# EAGLE design Inverter (EAGLE 9.6.2)
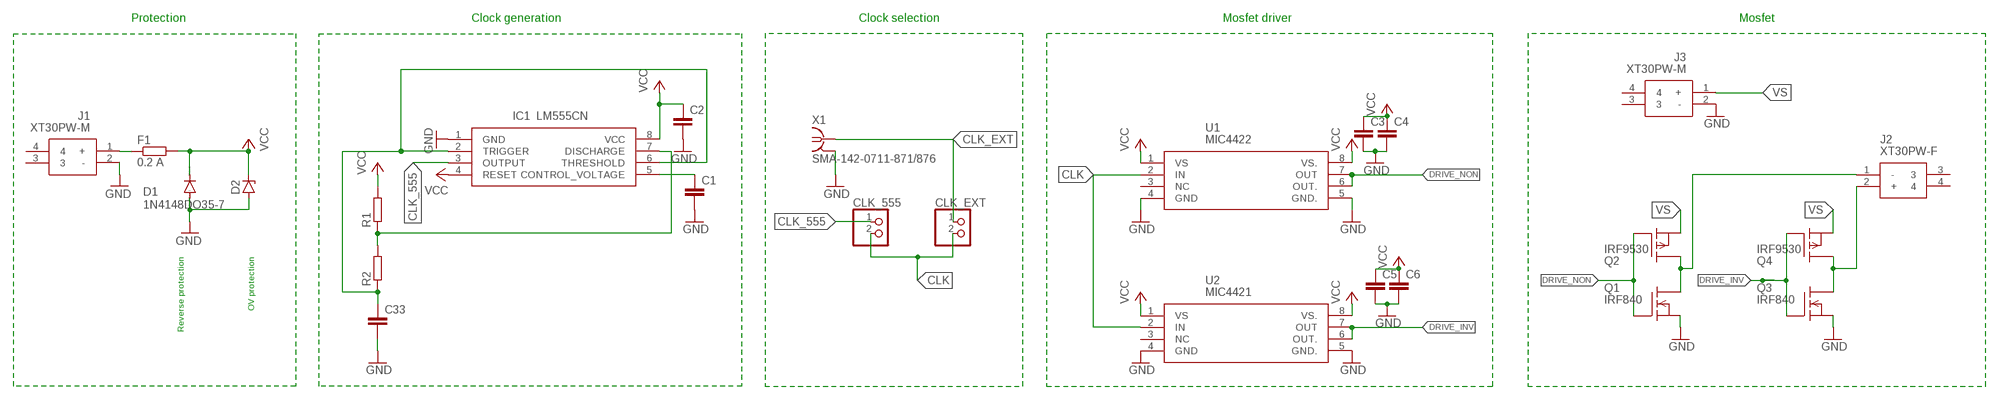
[diagram p0: schematic, sheet 1]

## Parts
C1  C-EU025-050X050  [C025-050X050]
C2  C-EUC0805  [C0805]
C3  C-EUC0805  [C0805]
C4  C-EUC0805  [C0805]
C5  C-EUC0805  [C0805]
C6  C-EUC0805  [C0805]
C33  C-EUC0805  [C0805]
CLK_555  PINHD-1X2  [1X02]
CLK_EXT  PINHD-1X2  [1X02]
D1  1N4148DO35-7  [DO35-7]
D2  ZENER-DIODEDO35Z10  [DO35Z10]
F1  0.2 A  R-EU_M1206  [M1206]
IC1  LM555CN  [DIP762W53P254L980H533Q8N]
J1  XT30PW-M  [XT30PWM]
J2  XT30PW-F  [XT30PWF]
J3  XT30PW-M  [XT30PWM]
Q1  IRF840  [TO220]
Q2  IRF9530  [TO220]
Q3  IRF840  [TO220]
Q4  IRF9530  [TO220]
R1  R-EU_M0805  [M0805]
R2  R-EU_M0805  [M0805]
U1  MIC4422  MIC4421!  [MIC4421]
U2  MIC4421  MIC4421!  [MIC4421]
X1  SMA-142-0711-871/876  [J502-ND-142-0711-871/876]

## Nets
CLK: CLK_555.2 CLK_EXT.2 U1.2(IN) U2.2(IN)
CLK_555: CLK_555.1 IC1.3(OUTPUT)
CLK_EXT: CLK_EXT.1 X1.1
DRIVE_INV: Q3.1(G) Q4.1(G) U2.6(OUT.) U2.7(OUT)
DRIVE_NON: Q1.1(G) Q2.1(G) U1.6(OUT.) U1.7(OUT)
GND: C1.2 C2.2 C3.2 C4.2 C5.2 C6.2 C33.2 D1.A D2.A IC1.1(GND) J1.2(-) J3.2(-) Q1.3(S) Q3.3(S) U1.4(GND) U1.5(GND.) U2.4(GND) U2.5(GND.) X1.G@1 X1.G@2 X1.G@3 X1.G@4
N$1: C33.1 IC1.2(TRIGGER) IC1.6(THRESHOLD) R2.1
N$2: IC1.7(DISCHARGE) R1.1 R2.2
N$3: C1.1 IC1.5(CONTROL_VOLTAGE)
N$4: J2.1(-) Q1.2(D) Q2.2(D)
N$5: J2.2(+) Q3.2(D) Q4.2(D)
N$11: F1.1 J1.1(+)
VCC: C2.1 C3.1 C4.1 C5.1 C6.1 D1.C D2.C F1.2 IC1.4(RESET) IC1.8(VCC) R1.2 U1.1(VS) U1.8(VS.) U2.1(VS) U2.8(VS.)
VS: J3.1(+) Q2.3(S) Q4.3(S)
Unconnected: J1.3 J1.4 J2.3 J2.4 J3.3 J3.4 U1.3(NC) U2.3(NC)

## Notes on the sheet
- Protection | Clock generation | Clock selection | Mosfet driver | Mosfet
- Reverse protection | OV protection

## Library data of the parts
C1-C6 C33 = rcl:C-EU: CAPACITOR, European symbol; SPICEPREFIX: C
CLK_555 CLK_EXT = pinhead:PINHD-1X2: PIN HEADER
D1 = diode:1N4148: DIODE high speed (Philips)
D2 = diode:ZENER-DIODE: Z-Diode
F1 R1 R2 = rcl:R-EU_: RESISTOR, European symbol; SPICEPREFIX: R
IC1 = LM555CN:LM555CN: ON Semiconductor LM555CN, Timer, 4.5 16 V, 8-Pin PDIP Source: Datasheet <http://www.onsemi.com/pub/Collateral/LM555-D.pdf>; ARROW_PART_NUMBER: LM555CN; ARROW_PRICE-STOCK: https://www.arrow.com/en/products/lm555cn/on-semiconductor; DESCRIPTION: ON Semiconductor LM555CN, Timer, 4.5 16 V, 8-Pin PDIP; HEIGHT: 5.33mm; MANUFACTURER_NAME: ON Semiconductor; MANUFACTURER_PART_NUMBER: LM555CN; MOUSER_PART_NUMBER: 512-LM555CN; MOUSER_PRICE-STOCK: https://www.mouser.co.uk/ProductDetail/ON-Semiconductor-Fairchild/LM555CN?qs=AFLC8Sm4xaX0SxPz974UPA%3D%3D
J1 J3 = XT30PW-M:XT30PW-M: 30A Low Temperature Rise Fire Retardant Plug Source: Datasheet <https://www.tme.eu/sl/Document/ce4077e36b79046da520ca73227e15de/XT30PW SPEC.pdf>; ARROW_PART_NUMBER: XT30PW-M; DESCRIPTION: 30A Low Temperature Rise Fire Retardant Plug; HEIGHT: 5mm; MANUFACTURER_NAME: Amass; MANUFACTURER_PART_NUMBER: XT30PW-M
J2 = XT30PW-F:XT30PW-F: Socket; DC supply; XT30; female; PIN:2; on PCBs; THT; Colour: yellow Source: Datasheet <https://www.tme.eu/Document/ce4077e36b79046da520ca73227e15de/XT30PW SPEC.pdf>; ARROW_PART_NUMBER: XT30PW-F; DESCRIPTION: Socket; DC supply; XT30; female; PIN:2; on PCBs; THT; Colour: yellow; HEIGHT: 5mm; MANUFACTURER_NAME: Amass; MANUFACTURER_PART_NUMBER: XT30PW-F
Q1 Q3 = transistor-fet:IRF840: N-Channel Enhancement MOSFET (HEXFET); 500V; 8A; 0,85Ohm
Q2 Q4 = transistor-fet:IRF9530: P-Channel Enhancement MOSFET (HEXFET); -100V; -12A; 0,3Ohm
U1 U2 = MIC4421:MIC4421!
X1 = con-coax:SMA-: SMA 50 Ohm End Launch Jack Receptacle - Round Contact Johnson Components Source: www.johnsoncomponents.com .. J502-ND.pdf; MF: JOHNSON COMPONENTS; MPN: 142-0711-871; OC_FARNELL: unknown; OC_NEWARK: 01C1639

## Board
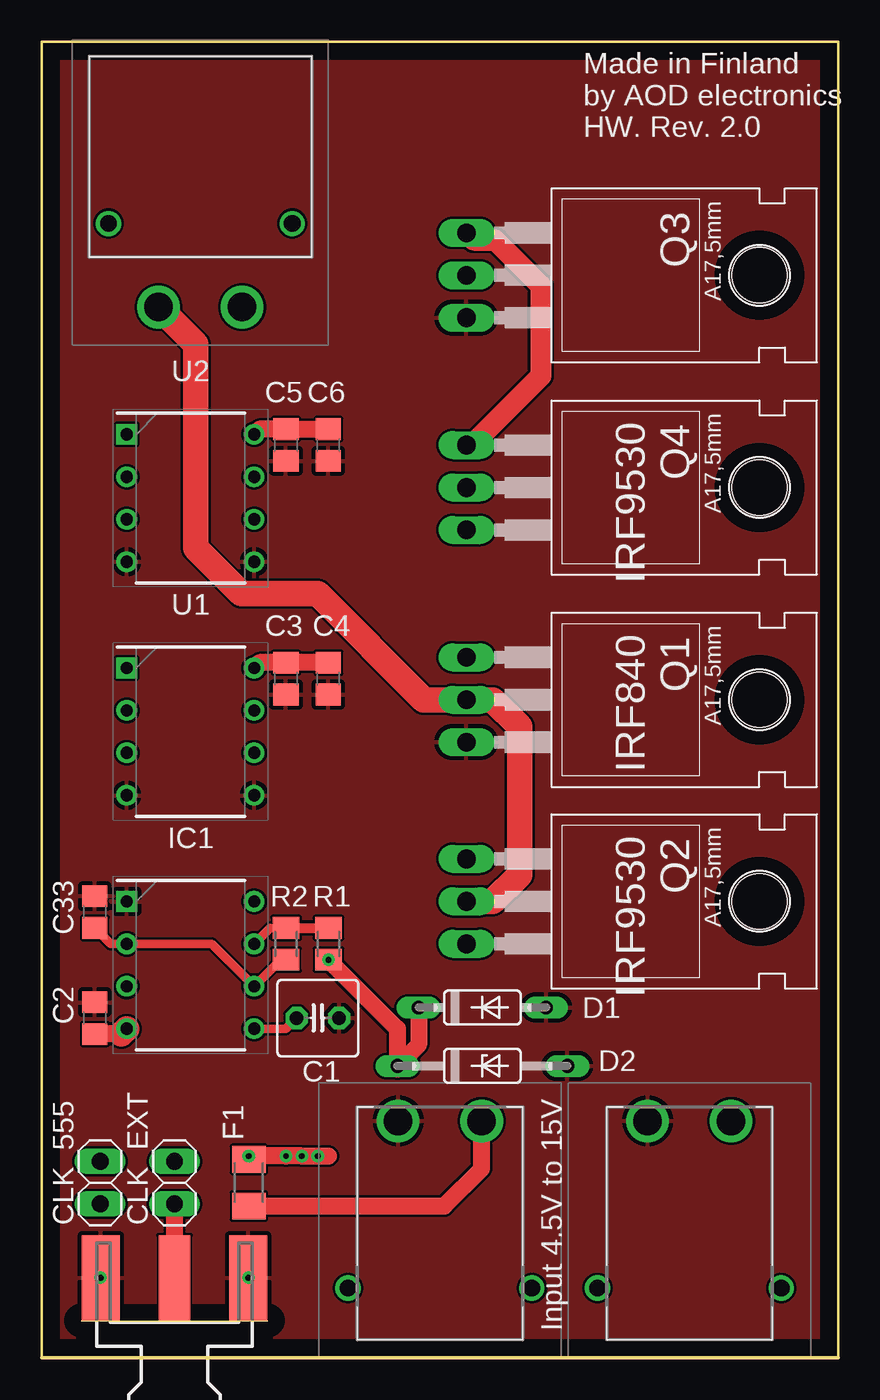
[diagram p1: board, top side]
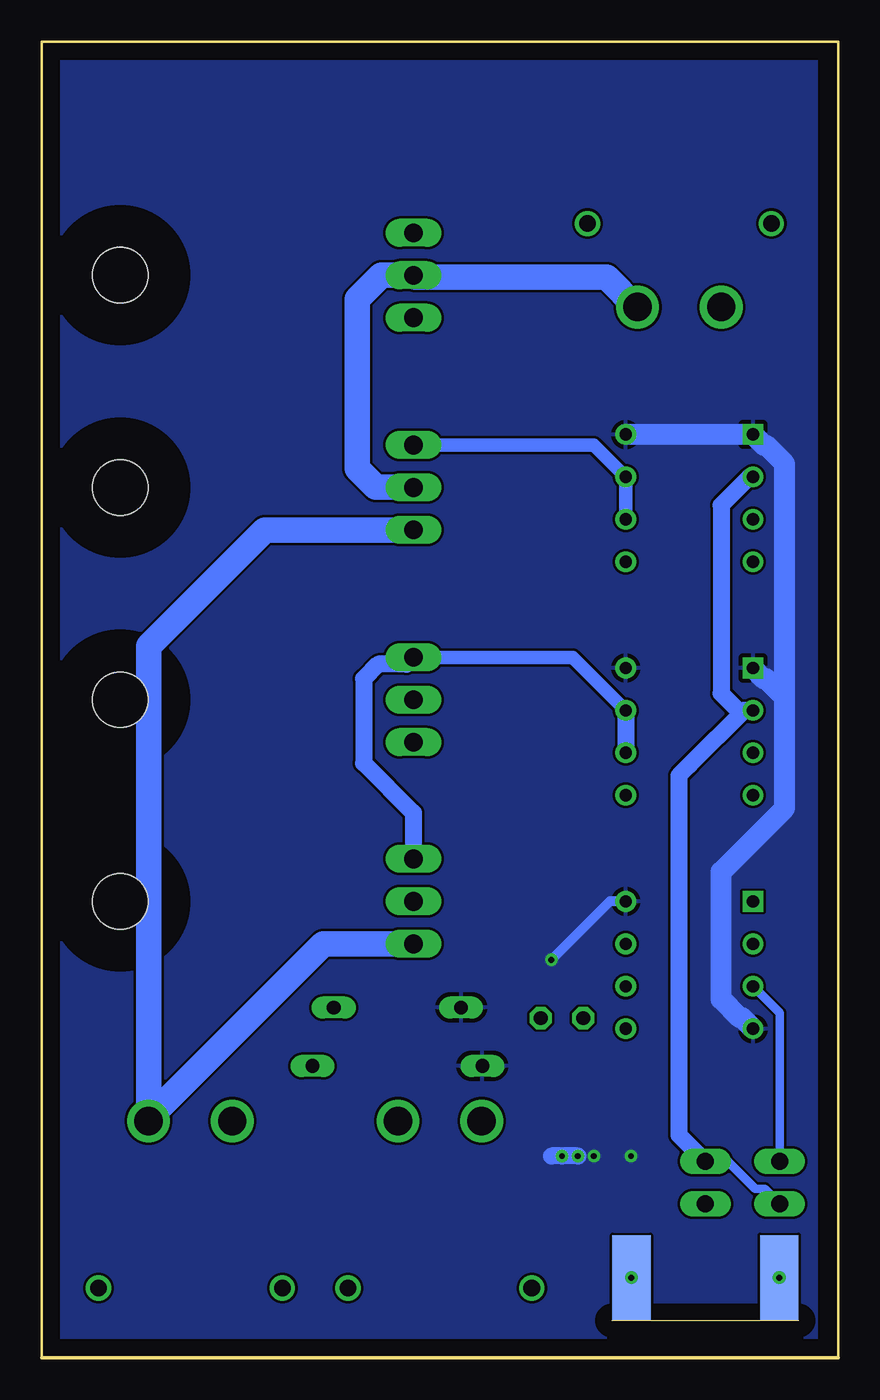
[diagram p2: board, bottom side, seen from below]

Size 47.62 x 78.74 mm. Coordinates in mm from the lower left corner, seen from the top.
Outline: 47.62,0 47.62,78.74 0,78.74 0,0 47.62,0
Copper layers (1*16): Top 0.035mm / dielectric 1.5mm / Bottom 0.035mm
Design rules "default *": minimum track width 6mil, minimum drill 0.35mm, track to track 6mil, track to pad 25mil, pad to pad 6mil, via to via 6mil, smd to smd 6mil, copper to edge 40mil, drill to drill 6mil, minimum pad ring 10mil, minimum via ring 8mil, stop-mask expansion 4mil, vias tented up to drill 0mil, thermal gap 10mil

### Footprints (pad centres in the part's own frame; a part is rotated, then mirrored left to right if it is on the bottom)
C025-050X050 = drill 0.813 octagon: 1 -1.27,0; 2 1.27,0
C0805 = smd 1.3 x 1.5: 1 -0.95,0; 2 0.95,0
1X02 = drill 1.016 long: 1 -1.27,0; 2 1.27,0
DO35-7 = drill 0.813 long: A 3.81,0; C -3.81,0
DO35Z10 = drill 0.813 long: A 5.08,0; C -5.08,0
M1206 = smd 1.6 x 2: 1 -1.4,0; 2 1.4,0
DIP762W53P254L980H533Q8N = drill 0.73 pad 1.13 square: 1 -3.81,3.81 | drill 0.73 pad 1.13: 2 -3.81,1.27; 3 -3.81,-1.27; 4 -3.81,-3.81; 5 3.81,-3.81; 6 3.81,-1.27; 7 3.81,1.27; 8 3.81,3.81
XT30PWM = drill 1.7 pad 2.55: 1 -2.5,-5.912; 2 2.5,-5.912 | drill 1 pad 1.5: 3 5.5,4.088; 4 -5.5,4.088
XT30PWF = drill 1.7 pad 2.55: 1 0,0; 2 5,0 | drill 1 pad 1.5: 3 -3,5; 4 8,5
TO220 = drill 1.118 long: 1 -2.54,-6.35; 2 0,-6.35; 3 2.54,-6.35 | hole 3.302: 0,11.176
M0805 = smd 1.3 x 1.6: 1 -0.95,0; 2 0.95,0
MIC4421 = drill 0.73 pad 1.13 square: 1 -3.81,3.81 | drill 0.73 pad 1.13: 2 -3.81,1.27; 3 -3.81,-1.27; 4 -3.81,-3.81; 5 3.81,-3.81; 6 3.81,-1.27; 7 3.81,1.27; 8 3.81,3.81
J502-ND-142-0711-871/876 = smd 5.08 x 1.905: 1 2.565,0 | smd 5.08 x 2.286: G@1 2.565,4.42; G@2 2.565,-4.42 | smd 5.08 x 2.286 bottom: G@3 2.565,4.42; G@4 2.565,-4.42

### Placement (x,y rotation side)
C1  16.51,20.32 0 top
C2  3.17,20.32 90 top
C3  14.61,40.64 270 top
C4  17.15,40.64 270 top
C5  14.61,54.61 270 top
C6  17.15,54.61 270 top
C33  3.17,26.67 90 top
CLK_555  3.49,10.48 270 top
CLK_EXT  7.94,10.48 90 top
D1  26.35,20.96 0 top
D2  26.35,17.46 0 top
F1  12.38,10.48 90 top
IC1  8.89,23.5 0 top
J1  23.81,8.26 180 top
J2  6.98,62.86 0 top
J3  38.73,8.26 180 top
Q1  31.75,39.37 270 top
Q2  31.75,27.31 270 top
Q3  31.75,64.77 270 top
Q4  31.75,52.07 270 top
R1  17.15,24.77 270 top
R2  14.61,24.77 90 top
U1  8.89,37.46 0 top
U2  8.89,51.43 0 top
X1  7.94,2.22 90 top

### Tracks (layer width: path | path; a pad name or v marks a point on that pad's centre or on a via)
CLK
  Bottom 0.508: CLK_555.2 4.38,10.1 4.94,10.1 6.59,11.75 CLK_EXT.2
  Bottom 1.016: U2.2 5.3,52.7 6.99,51.01 6.99,39.75 5.98,38.73 U1.2 5.62,38.73 8.89,35.46 9.53,34.83 9.53,13.33 CLK_EXT.2
CLK_555
  Bottom 0.508: CLK_555.1 3.49,20.64 IC1.3
CLK_EXT
  Top 1.016: CLK_EXT.1 7.94,5.71 7.94,4.13
  Top 1.524: X1.1 7.94,5.71
DRIVE_INV
  Top 1.27: Q3.1 25.83,66.88 27.11,66.88 29.85,64.14 29.85,58.74 25.72,54.61 Q4.1
  Bottom 0.813: U2.6 U2.7 14.61,54.61 Q4.1
DRIVE_NON
  Bottom 0.813: U1.7 15.88,41.91 Q1.1
  Bottom 1.016: Q1.1 25.81,41.5 27.49,41.5 28.37,40.63 28.37,35.57 25.4,32.6 Q2.1 | U1.7 U1.6
GND  (via drill 0.35)
  other vias: 12.36,4.79 3.52,4.79
  pour Top: 0.32,92.08 0.32,-0.32 49.21,-0.32 49.21,92.08
N$1
  Top 0.508: R2.1 14.29,23.82 IC1.6 10.16,24.77 IC1.2 4.13,24.77 C33.1
N$2
  Top 0.152: 13.65,25.71
  Top 0.203: R2.2 13.65,25.71
  Top 0.508: 13.65,25.71 IC1.7
  Top 0.61: R2.2 R1.1
N$3
  Top 0.508: IC1.5 14.61,19.69 C1.1
N$4
  Top 1.524: Q2.2 26.99,27.31 28.58,28.89 28.58,37.78 26.99,39.37 Q1.2 22.86,39.37 16.51,45.72 11.93,45.72 9.21,48.45 9.21,60.64 J2.1
N$5
  Bottom 1.524: Q4.2 25.43,52.09 27.65,52.09 28.75,53.2 28.75,63.33 27.31,64.77 Q3.2 25.29,64.66 13.85,64.66 12.05,62.86 J2.2
N$11
  Top 1.016: F1.1 24.08,9.08 26.31,11.31 J1.1
VCC  (via drill 0.35)
  Top 0.61: R1.2
  Top 1.016: C4.1 C3.1 13.02,41.59 U1.8 | 4.76,19.37 C2.1 | C6.1 C5.1 13.02,55.56 U2.8 | R1.2 21.27,19.69 D2.C | D1.C 22.54,18.73 D2.C | D2.C 21.27,17.28 | F1.2 12.57,12.06 v14.61,12.06 v15.56,12.06 v16.51,12.06 17.15,12.06
  Top 1.524: IC1.4 4.76,19.37
  Bottom 0.61: IC1.8 13.65,27.31 R1.2
  Bottom 1.016: v15.56,12.06 v16.51,12.06 17.15,12.06
  Bottom 1.27: U2.8 U2.1 4.43,54.59 4.3,54.59 3.19,53.49 3.19,39.52 | IC1.4 5.73,20.34 5.86,20.34 6.98,21.46 6.98,29.08 3.19,32.87 3.19,39.52 | 3.19,39.52 4.3,40.62 4.43,40.62 U1.1
  other vias: 17.15,23.81 12.38,12.06
  pour Bottom: 1.27,79.38 48.89,79.38 48.89,0 1.27,0
VS
  Bottom 1.524: J3.1 41.23,14.33 | 41.23,14.33 41.23,42.59 34.29,49.53 Q4.3 | 41.23,14.33 30.8,24.77 Q2.3

### Text on the board
tPlace: Made in Finland / by AOD electronics / HW. Rev. 2.0 | Input 4.5V to 15V